# Altium schematic sheet Main.SchDoc
size Legal
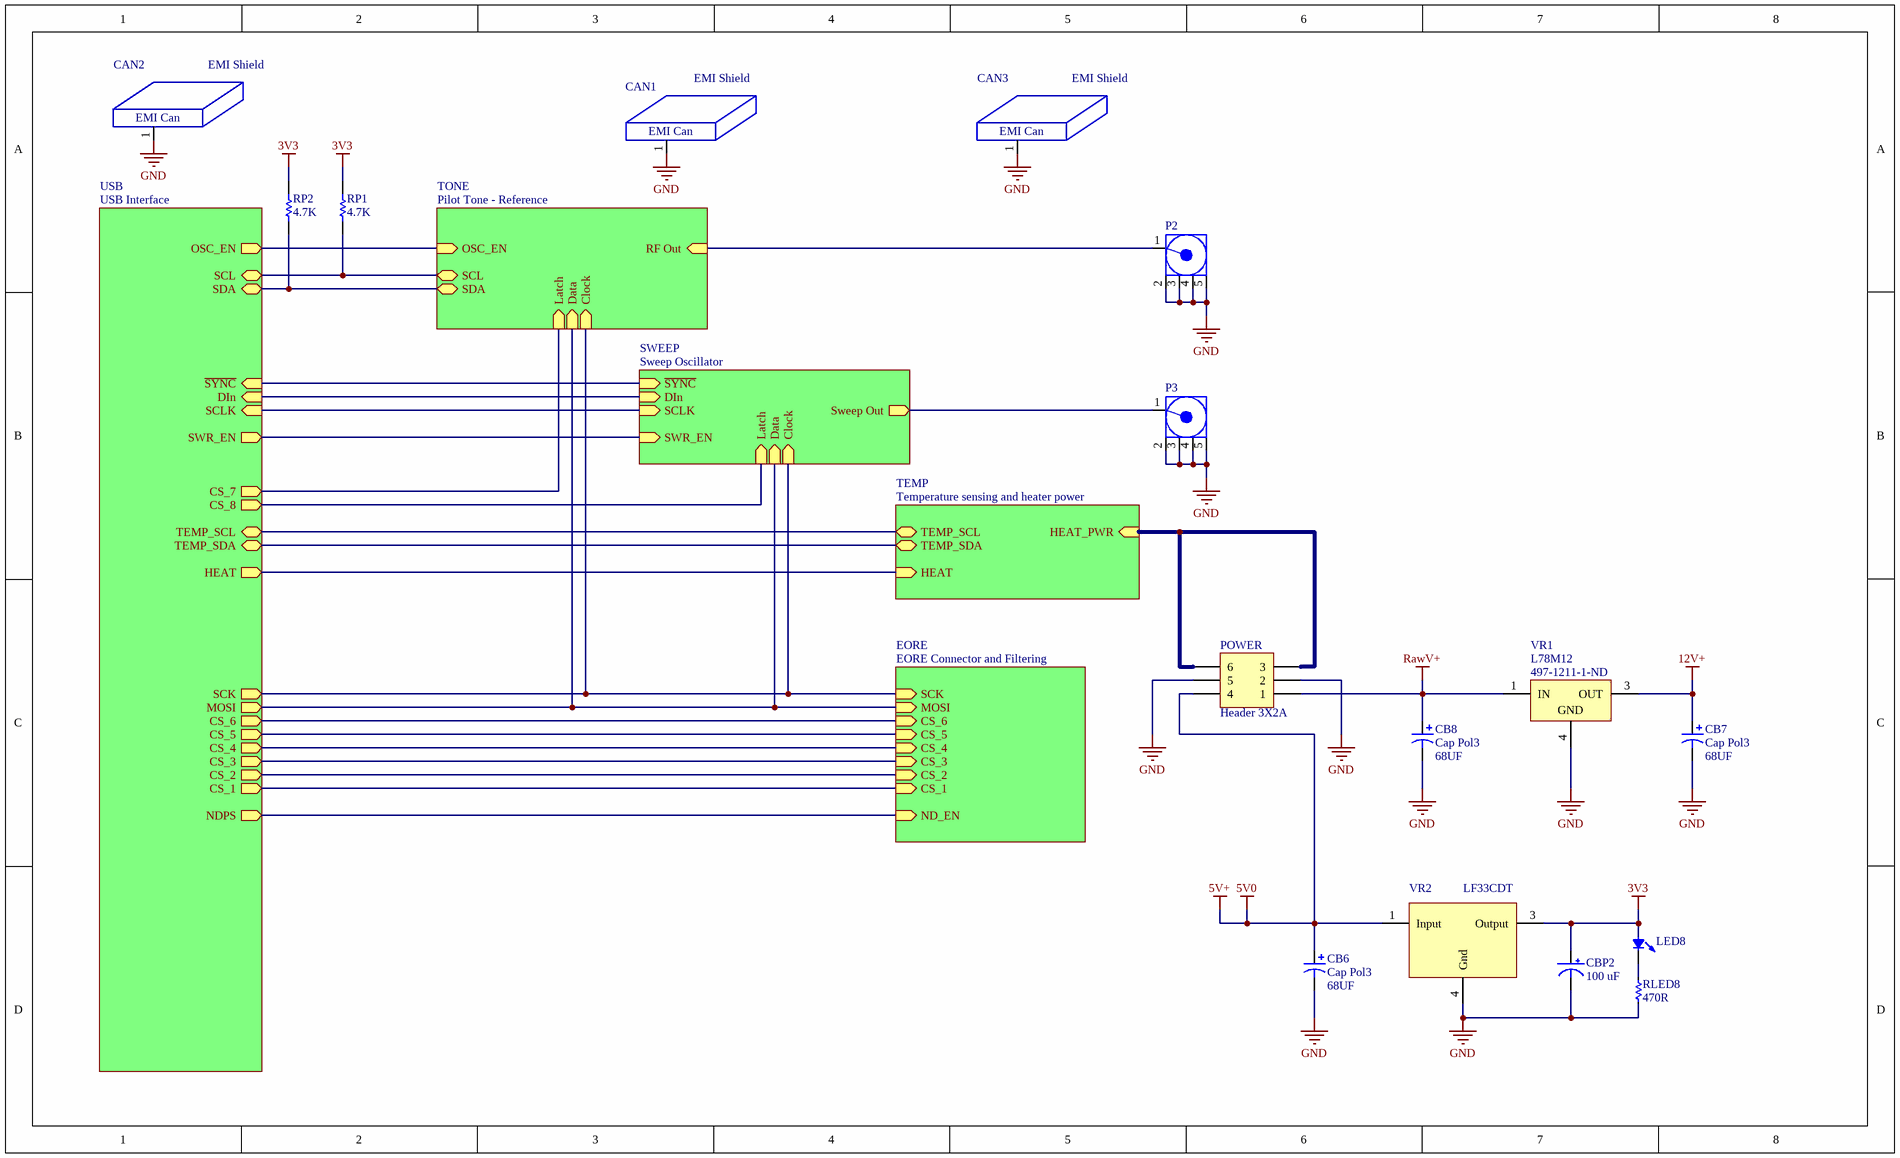
[diagram p0: Main.SchDoc]

## Parts
CAN1  EMI Shield  [BMI-S-230-F]
CAN2  EMI Shield  [BMI-S-230-F]
CAN3  EMI Shield  [BMI-S-230-F]
CB6  Cap Pol3  value 68UF  [V]
CB7  Cap Pol3  value 68UF  [V]
CB8  Cap Pol3  value 68UF  [V]
CBP2  100 uF  [V]
LED8  LED0  [0603 SMT LED]  (value not drawn)
P2  COAX-M  [SMA Jack - PCB Edge - MultiSize]  (value not drawn)
P3  COAX-M  [SMA Jack - PCB Edge - MultiSize]  (value not drawn)
POWER  Header 3X2A  [Molex Mini-Fit Jr 5569 - 6 Pin, RA]
RLED8  value 470R  [0603R]  (hidden comment: Res Semi Small)
RP1  value 4.7K  [0603R]  (hidden comment: Res Semi)
RP2  value 4.7K  [0603R]  (hidden comment: Res Semi)
VR1  L78M12  DKPN: 497-1211-1-ND  [TO228P1000-3_4N]
VR2  LF33CDT  [TO228P1000-3_4N]

## Sub-sheets
EORE = EORE Connector and Filtering: SCK (in), MOSI (in), CS_1 (in), CS_2 (in), CS_3 (in), CS_4 (in), CS_5 (in), CS_6 (in), ND_EN (in)
SWEEP = Sweep Oscillator: Clock (in), Data (in), Latch (in), Sweep Out (out), SWR_EN (in), ~{SYNC} (in), DIn (in), SCLK (in)
TEMP = Temperature sensing and heater power: TEMP_SCL (bidir), TEMP_SDA (bidir), HEAT (in), HEAT_PWR (in)
TONE = Pilot Tone - Reference: SCL (bidir), SDA (bidir), OSC_EN (in), Clock (in), Data (in), Latch (in), RF Out (in)
USB = USB Interface: SCL (bidir), SDA (bidir), SCK (out), MOSI (out), CS_1 (out), CS_2 (out), CS_3 (out), CS_4 (out), CS_5 (out), CS_6 (out), NDPS (out), OSC_EN (out), CS_7 (out), HEAT (out), CS_8 (out), SWR_EN (out), TEMP_SCL (bidir), TEMP_SDA (bidir), ~{SYNC} (in), DIn (in), SCLK (in)

## Nets
3V3: CBP2.1 LED8.1 RP1.2 RP2.2 VR2.3(Output)
5V+: CB6.1 POWER.4 VR2.1(Input)  [also labelled 5V0]
12V+: CB7.1 VR1.3(OUT)
GND: CAN1.1 CAN2.1 CAN3.1 CB6.2 CB7.2 CB8.2 CBP2.2 P2.2(GND) P2.3(GND) P2.4(GND) P2.5(GND) P3.2(GND) P3.3(GND) P3.4(GND) P3.5(GND) POWER.2 POWER.5 RLED8.2 VR1.4(GND) VR2.4(Gnd)
RawV+: CB8.1 POWER.1 VR1.1(IN)
NetLED8_2: LED8.2 RLED8.1
NetP2_1: P2.1(Signal) ; sheet TONE/RF Out
NetP3_1: P3.1(Signal) ; sheet SWEEP/Sweep Out
NetPOWER_3: POWER.3 POWER.6 ; sheet TEMP/HEAT_PWR
NetRP1_1: RP1.1 ; sheet USB/SCL, sheet TONE/SCL
NetRP2_1: RP2.1 ; sheet USB/SDA, sheet TONE/SDA
(unnamed): sheet USB/SCK, sheet TONE/Clock, sheet SWEEP/Clock, sheet EORE/SCK
(unnamed): sheet USB/MOSI, sheet TONE/Data, sheet SWEEP/Data, sheet EORE/MOSI
(unnamed): sheet USB/CS_1, sheet EORE/CS_1
(unnamed): sheet USB/CS_2, sheet EORE/CS_2
(unnamed): sheet USB/CS_3, sheet EORE/CS_3
(unnamed): sheet USB/CS_4, sheet EORE/CS_4
(unnamed): sheet USB/CS_5, sheet EORE/CS_5
(unnamed): sheet USB/CS_6, sheet EORE/CS_6
(unnamed): sheet USB/NDPS, sheet EORE/ND_EN
(unnamed): sheet USB/OSC_EN, sheet TONE/OSC_EN
(unnamed): sheet USB/CS_7, sheet TONE/Latch
(unnamed): sheet USB/HEAT, sheet TEMP/HEAT
(unnamed): sheet USB/CS_8, sheet SWEEP/Latch
(unnamed): sheet USB/SWR_EN, sheet SWEEP/SWR_EN
(unnamed): sheet USB/TEMP_SCL, sheet TEMP/TEMP_SCL
(unnamed): sheet USB/TEMP_SDA, sheet TEMP/TEMP_SDA
(unnamed): sheet USB/~{SYNC}, sheet SWEEP/~{SYNC}
(unnamed): sheet USB/DIn, sheet SWEEP/DIn
(unnamed): sheet USB/SCLK, sheet SWEEP/SCLK

## Notes on the sheet
- (in symbol BMI-S-205-F RF/EMI Can) EMI Can
- (in symbol BMI-S-230-F-R RF/EMI Can) EMI Can

## Library data of the parts
CAN1 = BMI-S-205-F RF/EMI Can: Laird Technologies 2-part EMI can; DKPN: Base: 903-1054-1-ND Cover: 903-1017-ND
CAN2 CAN3 = BMI-S-230-F-R RF/EMI Can: Laird Technologies 2-part EMI can; DKPN: Base: 903-1470-1-ND Cover: 903-1471-ND
CB6-CB8 = Cap Pol3: KEMET T520 KO-CAP  Polymer SMT Tantalum; DKPN: 399-3330-1-ND; Voltage: 10V; Type: KEMET T520 KO-CAP  Polymer SMT Tantalum
CBP2 = 100 uf SMT Panasonic Cap
LED8 = LED0: T 1 3/4 LED; Published: 8-Jun-2000; LatestRevisionDate: 08-Jul-2005; LatestRevisionNote: Mech Layer 1 removed.; PackageReference: LED-0; Publisher: Altium Limited
P2 P3 = COAX-M: RF Coaxial PCB Connector, MMCX; Thru-Hole, Vertical Mount Plug,  50 Ohm Impedance; PackageDocument: Rev. A, 16-Jun-1997; PCB_Layout: Complies with manufacturer's recommendation.; DrillSize: Corresponds to nominal value.; Published: 15-Jul-2004; LatestRevisionDate: 15-Jul-2004; LatestRevisionNote: Component Replaced.; DatasheetDocument: 30-May-2003; PackageReference: 908-21103; Publisher: Altium Limited; ComponentLink1Description: Manufacturer Link; ComponentLink1URL: http://www.amphenolrf.com/
POWER = Header 3X2A: Header, 3-Pin, Dual row; LatestRevisionDate: 17-Jul-2002; LatestRevisionNote: Re-released for DXP Platform.; Publisher: Altium Limited
RLED8 = Res Semi Small: Semiconductor Resistor; Published: 8-Jun-2000; LatestRevisionDate: 17-Jul-2002; LatestRevisionNote: Re-released for DXP Platform.; PackageReference: AXIAL-0.5; Publisher: Altium Limited
RP1 RP2 = Res Semi: Semiconductor Resistor; Published: 8-Jun-2000; LatestRevisionDate: 17-Jul-2002; LatestRevisionNote: Re-released for DXP Platform.; PackageReference: AXIAL-0.5; Publisher: Altium Limited
VR1 = MC78M05ACDT: Three-Terminal Medium Current Positive Voltage Regulator; Note: Pin 2 is electrically connected to Pin 4; Pin 2 is trimmed and not drawn;; Published: 15-Apr-2002; DatasheetVersion: Apr-2000; PackageVersion: 1997; PackageReference: 369A-13; Publisher: Altium Limited; PackageDescription: D-PAK/TO-252-AA; 3 Leads (1 Cropped); Body 10.3 (inc. leads) x 6.7 mm (LxW max); ComponentLink1Description: Manufacturer Link; ComponentLink1URL: http://www.onsemi.com/site/products/taxonomy/0,4438,503,00.html; ComponentLink2Description: Datasheet; ComponentLink2URL: http://www.onsemi.com/pub/Collateral/MC78M00-D.PDF
VR2 = LF33CDT: Very low drop 500 ma voltage regulators; DKPN: 497-1532-1-ND